# EAGLE schematic pasivizator3 (EAGLE 7.3.0)
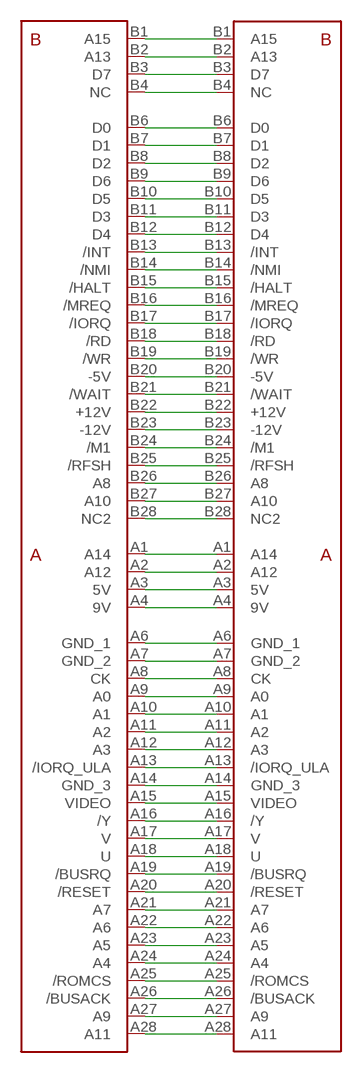
[diagram p0: schematic, sheet 1]

## Parts
U$1  ZXSP_ED2X28_SPE_SOL_EDGE  [2X28_SPE2]
U$3  ZXSP_ED2X28_SPE_SOL_EDGE  [2X28_SPE2]

## Nets
N$1: U$1.B22(+12V) U$3.B22(+12V)
N$2: U$1.B20(-5V) U$3.B20(-5V)
N$3: U$1.B23(-12V) U$3.B23(-12V)
N$4: U$1.A26(/BUSACK) U$3.A26(/BUSACK)
N$5: U$1.A19(/BUSRQ) U$3.A19(/BUSRQ)
N$6: U$1.B15(/HALT) U$3.B15(/HALT)
N$7: U$1.B13(/INT) U$3.B13(/INT)
N$8: U$1.B17(/IORQ) U$3.B17(/IORQ)
N$9: U$1.A13(/IORQ_ULA) U$3.A13(/IORQ_ULA)
N$10: U$1.B24(/M1) U$3.B24(/M1)
N$11: U$1.B16(/MREQ) U$3.B16(/MREQ)
N$12: U$1.B14(/NMI) U$3.B14(/NMI)
N$13: U$1.B18(/RD) U$3.B18(/RD)
N$14: U$1.A20(/RESET) U$3.A20(/RESET)
N$15: U$1.B25(/RFSH) U$3.B25(/RFSH)
N$16: U$1.A25(/ROMCS) U$3.A25(/ROMCS)
N$17: U$1.B21(/WAIT) U$3.B21(/WAIT)
N$18: U$1.B19(/WR) U$3.B19(/WR)
N$19: U$1.A16(/Y) U$3.A16(/Y)
N$20: U$1.A3(5V) U$3.A3(5V)
N$21: U$1.A4(9V) U$3.A4(9V)
N$22: U$1.A9(A0) U$3.A9(A0)
N$23: U$1.A10(A1) U$3.A10(A1)
N$24: U$1.A11(A2) U$3.A11(A2)
N$25: U$1.A12(A3) U$3.A12(A3)
N$26: U$1.A24(A4) U$3.A24(A4)
N$27: U$1.A23(A5) U$3.A23(A5)
N$28: U$1.A22(A6) U$3.A22(A6)
N$29: U$1.A21(A7) U$3.A21(A7)
N$30: U$1.B26(A8) U$3.B26(A8)
N$31: U$1.A27(A9) U$3.A27(A9)
N$32: U$1.B27(A10) U$3.B27(A10)
N$33: U$1.A28(A11) U$3.A28(A11)
N$34: U$1.A2(A12) U$3.A2(A12)
N$35: U$1.B2(A13) U$3.B2(A13)
N$36: U$1.A1(A14) U$3.A1(A14)
N$37: U$1.B1(A15) U$3.B1(A15)
N$38: U$1.A8(CK) U$3.A8(CK)
N$39: U$1.B6(D0) U$3.B6(D0)
N$40: U$1.B7(D1) U$3.B7(D1)
N$41: U$1.B8(D2) U$3.B8(D2)
N$42: U$1.B11(D3) U$3.B11(D3)
N$43: U$1.B12(D4) U$3.B12(D4)
N$44: U$1.B10(D5) U$3.B10(D5)
N$45: U$1.B9(D6) U$3.B9(D6)
N$46: U$1.B3(D7) U$3.B3(D7)
N$47: U$1.A6(GND_1) U$3.A6(GND_1)
N$48: U$1.A7(GND_2) U$3.A7(GND_2)
N$49: U$1.A14(GND_3) U$3.A14(GND_3)
N$50: U$1.B4(NC) U$3.B4(NC)
N$51: U$1.B28(NC2) U$3.B28(NC2)
N$52: U$1.A18(U) U$3.A18(U)
N$53: U$1.A17(V) U$3.A17(V)
N$54: U$1.A15(VIDEO) U$3.A15(VIDEO)

## Library data of the parts
U$1 U$3 = zx_edge:ZXSP_ED